# EAGLE schematic OptolinkDuo3 (EAGLE 7.5.0)
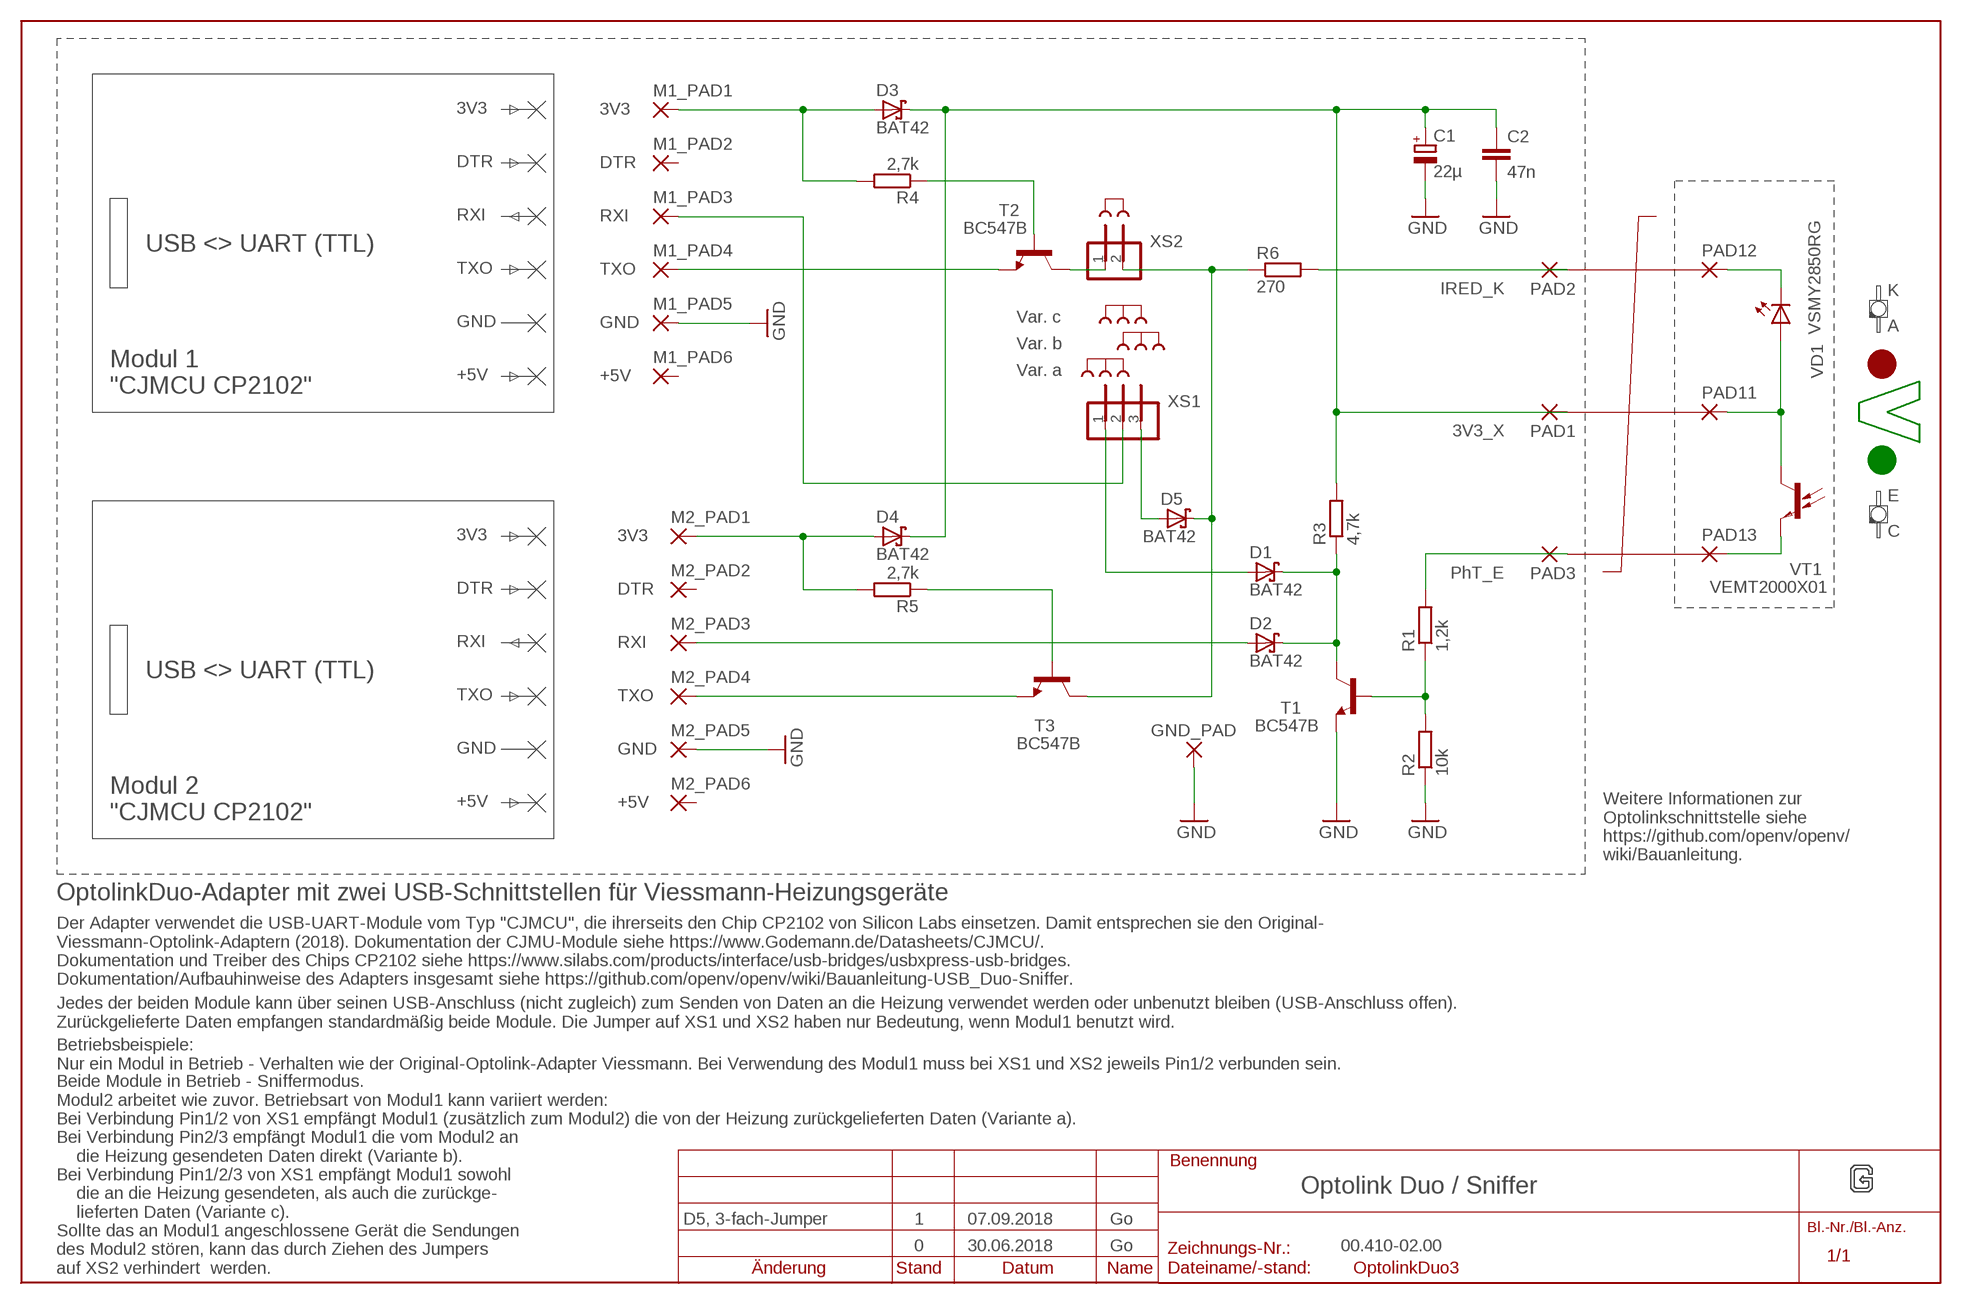
[diagram p0: schematic, sheet 1]

## Parts
3V3_XE  V  [V-PAC]
C1  22µ  CPOL-EUE2.5-5  [E2,5-5]
C2  47n  C-EU050-024X044  [C050-024X044]
D1  BAT42  [DO35-10]
D2  BAT42  [DO35-10]
D3  BAT42  [DO35-10]
D4  BAT42  [DO35-10]
D5  BAT42  [DO35-10]
GND_PAD  GND  2,15/1,0  [2,15/1,0]
J1  JUMPER  [JUMP]
J2  JUMPER  [JUMP]
M1_PAD1  3V3  2,15/1,0  [2,15/1,0]
M1_PAD2  DTR  2,15/1,0  [2,15/1,0]
M1_PAD3  RXI  2,15/1,0  [2,15/1,0]
M1_PAD4  TXO  2,15/1,0  [2,15/1,0]
M1_PAD5  GND  2,15/1,0  [2,15/1,0]
M1_PAD6  +5V  2,15/1,0  [2,15/1,0]
M2_PAD1  3V3  2,15/1,0  [2,15/1,0]
M2_PAD2  DTR  2,15/1,0  [2,15/1,0]
M2_PAD3  RXI  2,15/1,0  [2,15/1,0]
M2_PAD4  TXO  2,15/1,0  [2,15/1,0]
M2_PAD5  GND  2,15/1,0  [2,15/1,0]
M2_PAD6  +5V  2,15/1,0  [2,15/1,0]
PAD1  3V3_X  WIREPAD1,6/0,8  [1,6/0,8]
PAD2  IRED_K  WIREPAD1,6/0,8  [1,6/0,8]
PAD3  PhT_E  WIREPAD1,6/0,8  [1,6/0,8]
PAD11  3V3_x  WIREPADSMD1,27-254  [SMD1,27-2,54]
PAD12  IRED_K  WIREPADSMD1,27-254  [SMD1,27-2,54]
PAD13  PhT_E  WIREPADSMD1,27-254  [SMD1,27-2,54]
R1  1,2k  R-EU_0207/10  [0207/10]
R2  10k  R-EU_0207/10  [0207/10]
R3  4,7k  R-EU_0207/10  [0207/10]
R4  2,7k  R-EU_0207/10  [0207/10]
R5  2,7k  R-EU_0207/10  [0207/10]
R6  270  R-EU_0207/10  [0207/10]
T1  BC547B  BC547B-NPN-TO92-CBE  [TO92-CBE]
T2  BC547B  BC547B-NPN-TO92-CBE  [TO92-CBE]
T3  BC547B  BC547B-NPN-TO92-CBE  [TO92-CBE]
VD1  VSMY2850RG  VSMY8250_IRED_GULLWING(R)  [VISHAY_GULLWING(R)]
VT1  VEMT2000X01  VEMT2000X01_PHOTOTRS_GULLWING(R)  [VISHAY_GULLWING(R)]
XS1  PINHD-1X3  [1X03]
XS2  PINHD-1X2  [1X02]

## Nets
3V3_1: D3.A M1_PAD1.1(P) R4.2
3V3_2: D4.A M2_PAD1.1(P) R5.2
3V3_X: C1.+ C2.1 D3.C D4.C PAD1.1(P) R3.2
3V3_XE: PAD11.1(P) VD1.COLLECTOR(A) VT1.COLLECTOR(C)
GND: C1.- C2.2 GND_PAD.1(P) M1_PAD5.1(P) M2_PAD5.1(P) R2.1 T1.E
N$2: T2.C XS2.1
N$3: D2.A M2_PAD3.1(P)
N$4: D1.A XS1.1
N$5: D5.C R6.1 T3.C XS2.2
N$6: PAD12.1(P) VD1.EMITTER(C)
N$8: PAD13.1(P) VT1.EMITTER(E)
N$11: D5.A XS1.3
N$14: PAD3.1(P) R1.2
N$16: R1.1 R2.2 T1.B
N$17: D1.C D2.C R3.1 T1.C
N$18: M1_PAD3.1(P) XS1.2
N$21: R5.1 T3.B
N$22: R4.1 T2.B
N$23: PAD2.1(P) R6.2
TXO_1: M1_PAD4.1(P) T2.E
TXO_2: M2_PAD4.1(P) T3.E
Unconnected: 3V3_XE.H1 3V3_XE.H2 3V3_XE.H3 3V3_XE.H4 M1_PAD2.1(P) M1_PAD6.1(P) M2_PAD2.1(P) M2_PAD6.1(P)

## Notes on the sheet
- 3V3
- DTR
- RXI
- USB <> UART (TTL)
- TXO
- K
- GND | Var. c
- A
- Var. b
- +5V | Var. a
- Modul 1 
  "CJMCU CP2102"
- E
- 3V3 | C
- DTR
- RXI
- USB <> UART (TTL)
- TXO
- GND
- +5V
- Modul 2 
  "CJMCU CP2102"
- Weitere Informationen zur 
  Optolinkschnittstelle siehe 
  https://github.com/openv/openv/
  wiki/Bauanleitung.
- OptolinkDuo-Adapter mit zwei USB-Schnittstellen für Viessmann-Heizungsgeräte
- Der Adapter verwendet die USB-UART-Module vom Typ "CJMCU", die ihrerseits den Chip CP2102 von Silicon Labs einsetzen. Damit entsprechen sie den Original-
  Viessmann-Optolink-Adaptern (2018). Dokumentation der CJMU-Module siehe https://www.Godemann.de/Datasheets/CJMCU/. 
  Dokumentation und Treiber des Chips CP2102 siehe https://www.silabs.com/products/interface/usb-bridges/usbxpress-usb-bridges.
  Dokumentation/Aufbauhinweise des Adapters insgesamt siehe https://github.com/openv/openv/wiki/Bauanleitung-USB_Duo-Sniffer.
- Jedes der beiden Module kann über seinen USB-Anschluss (nicht zugleich) zum Senden von Daten an die Heizung verwendet werden oder unbenutzt bleiben (USB-Anschluss offen). 
  Zurückgelieferte Daten empfangen standardmäßig beide Module. Die Jumper auf XS1 und XS2 haben nur Bedeutung, wenn Modul1 benutzt wird.
- Betriebsbeispiele:
  Nur ein Modul in Betrieb - Verhalten wie der Original-Optolink-Adapter Viessmann. Bei Verwendung des Modul1 muss bei XS1 und XS2 jeweils Pin1/2 verbunden sein.
- Optolink Duo / Sniffer
- D5, 3-fach-Jumper | 1 | 07.09.2018 | Go
- 0 | 30.06.2018 | Go | 00.410-02.00
- Beide Module in Betrieb - Sniffermodus.
  Modul2 arbeitet wie zuvor. Betriebsart von Modul1 kann variiert werden:
  Bei Verbindung Pin1/2 von XS1 empfängt Modul1 (zusätzlich zum Modul2) die von der Heizung zurückgelieferten Daten (Variante a).
  Bei Verbindung Pin2/3 empfängt Modul1 die vom Modul2 an 
      die Heizung gesendeten Daten direkt (Variante b). 
  Bei Verbindung Pin1/2/3 von XS1 empfängt Modul1 sowohl
      die an die Heizung gesendeten, als auch die zurückge-
      lieferten Daten (Variante c).
  Sollte das an Modul1 angeschlossene Gerät die Sendungen
  des Modul2 stören, kann das durch Ziehen des Jumpers 
  auf XS2 verhindert  werden.

## Library data of the parts
3V3_XE = !My-Lib:V: Skizziert den V-Schlitz an Viessmann-Gastherme einschließlich der Anordung der LED. Enhält Pads zum Einlöten von Drahtstiften, um Optolink-Adapter zu fixieren.
C1 = rcl:CPOL-EU: POLARIZED CAPACITOR, European symbol
C2 = rcl:C-EU: CAPACITOR, European symbol
D1-D5 = diode:BAT42: DIODE barrier diode
GND_PAD M1_PAD1-M1_PAD6 M2_PAD1-M2_PAD6 = wirepad:2,15/1,0: THROUGH-HOLE PAD
J1 J2 = jumper:JUMPER: JUMPER header
PAD1-PAD3 PAD11-PAD13 = wirepad:WIREPAD: Wire PAD connect wire on PCB
R1-R6 = rcl:R-EU_: RESISTOR, European symbol
T1-T3 = transistor:*-NPN-: NPN Transistror BF959 corrected 2008.03.06
VD1 = vishay:VSMY8250_IRED_GULLWING(R): Vishay IRED VSMY8250 Erzeugt aus Kopie von Device "LUMILED_2K_GULLWING" der Eagle-Lib "lumiled.lib" Ursprügliche Quelle: 0041 Luxeon K2 on FR4 with open vias.pdf DS60.pdf
VT1 = vishay:VEMT2000X01_PHOTOTRS_GULLWING(R): Vishay Phototransistor VEMT 2000X01 Erzeugt als Kopie von Device "VSMY8250_IRED_GULLWING(R)"
XS1 = pinhead:PINHD-1X3: PIN HEADER
XS2 = pinhead:PINHD-1X2: PIN HEADER

## Module CJMCU
Ports: GND(io) N$1(io) N$2(io) N$3(nc) N$5(pwr) N$7(hiz)

### Library data of the parts